# Altium schematic sheet МПСУ-46342.21-004 Э3 Лист5.SchDoc
size 209 x 297 mm; Address1: Address1; Address2: Address2; Address3: Address3; Address4: Address4; SheetNumber: 1; Scale: 1:1; Разраб.: Муренков; Обозначение документа: МПСУ-46342.21-004 Э3; Пров.: Приходько; Номер листа: 1; Общее количество листов: 2; Литера: У; Наименование организации: МПСУ; Наименование изделия 1: Приёмная ячейка; Наименование изделия 2: Схема электрическая; Наименование изделия 3: принципиальная; Нач. отд.: Нач. отд.; Фамилия нач. отд.: Лялин
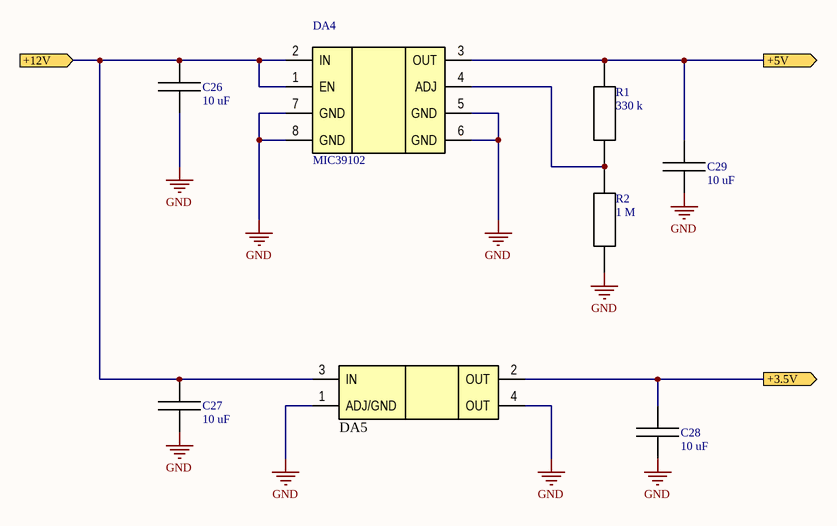
[diagram p0: МПСУ-46342.21-004 Э3 Лист5.SchDoc]

## Parts
C26  10 uF  [CAPC100X50X55L20N]
C27  10 uF  [CAPC100X50X55L20N]
C28  10 uF  [CAPC100X50X55L20N]
C29  10 uF  [CAPC100X50X55L20N]
DA4  MIC39102  [SOIC127P600X160-8N]
DA5  NCP1117LPST50T3G  [SOT223-4P230_700X180L92X74N]  (value not drawn)
R1  330 k  [RESC100X50X40L25N]
R2  1 M  [RESC100X50X40L25N]

## Ports
+3.5V (out), +5V (out), +12V (in)

## Nets
GND: C26.1 C27.1 C28.1 C29.1 DA4.5(GND) DA4.6(GND) DA4.7(GND) DA4.8(GND) DA5.1(ADJ/GND) DA5.4(OUT) R2.1
+3.5V: C28.2 DA5.2(OUT) ; port +3.5V
+5V: C29.2 DA4.3(OUT) R1.2 ; port +5V
+12V: C26.2 C27.2 DA4.1(EN) DA4.2(IN) DA5.3(IN) ; port +12V
NetDA4_4: DA4.4(ADJ) R1.1 R2.2

## Notes on the sheet
- Перв. примен.
- Справ. №
- Подп. и дата
- Инв. № дубл.
- Взам. инв. №
- Разраб.
- Изм.
- Лист
- № докум.
- Подп.
- Дата
- Лит.
- Масса
- Масштаб
- Пров.
- Т.контр.
- Листов
- Инв. № подл.
- Утв.
- Н.контр.
- Копировал
- Формат А4
- (in symbol MIC39102) Text

## Library data of the parts
C26-C29 = Capacitor: Capacitor, generic; Tolerance: 5 %; VDC: 20 V; Value: 10 uF; PartNumber: *; Dielectric: *; Manufacturer: *; Package: 0402
DA4 = MIC39102: 1A Low-Voltage Low-Dropout Regulator, Adj; Manufacturer: Microchip; PartNumber: MIC39102
DA5 = NCP1117LP: 1.0 A Low-Dropout Positive / Fixed and Adjustable / Voltage Regulators; Manufacturer: On Semiconductor; PartNumber: NCP1117LPST50T3G
R1 = Resistor: Resistor, generic; Value: 330 k; PartNumber: *; Tolerance: *; Power: *; DCV: *; Manufacturer: *; Package: 0402
R2 = Resistor: Resistor, generic; Tolerance: 5 %; Power: 20 V; Value: 1 M; PartNumber: *; DCV: *; Manufacturer: *; Package: 0402